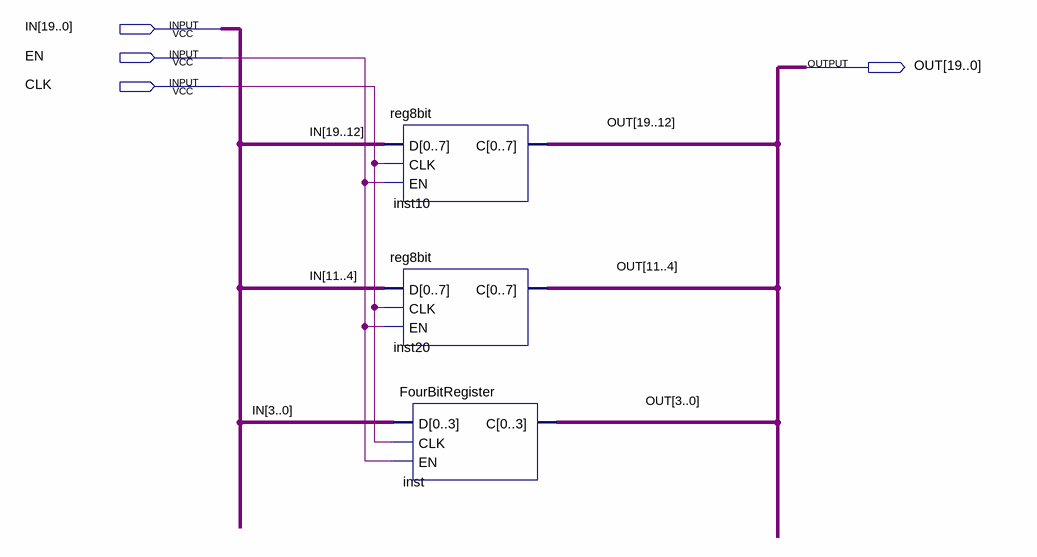
[diagram p0: schematic sheet]
// Quartus schematic reg20bit.bdf as structural Verilog: 3 symbols, 4 pins
module reg20bit (
  input  [19:0] IN,
  input  EN,
  input  CLK,
  output [19:0] OUT
);

  reg8bit inst10 (.D(IN[19:12]), .CLK(CLK), .EN(EN), .C(OUT[19:12]));
  reg8bit inst20 (.D(IN[11:4]), .CLK(CLK), .EN(EN), .C(OUT[11:4]));
  FourBitRegister inst (.D(IN[3:0]), .CLK(CLK), .EN(EN), .C(OUT[3:0]));
endmodule
